# Altium project PCB_Project1.PrjPCB
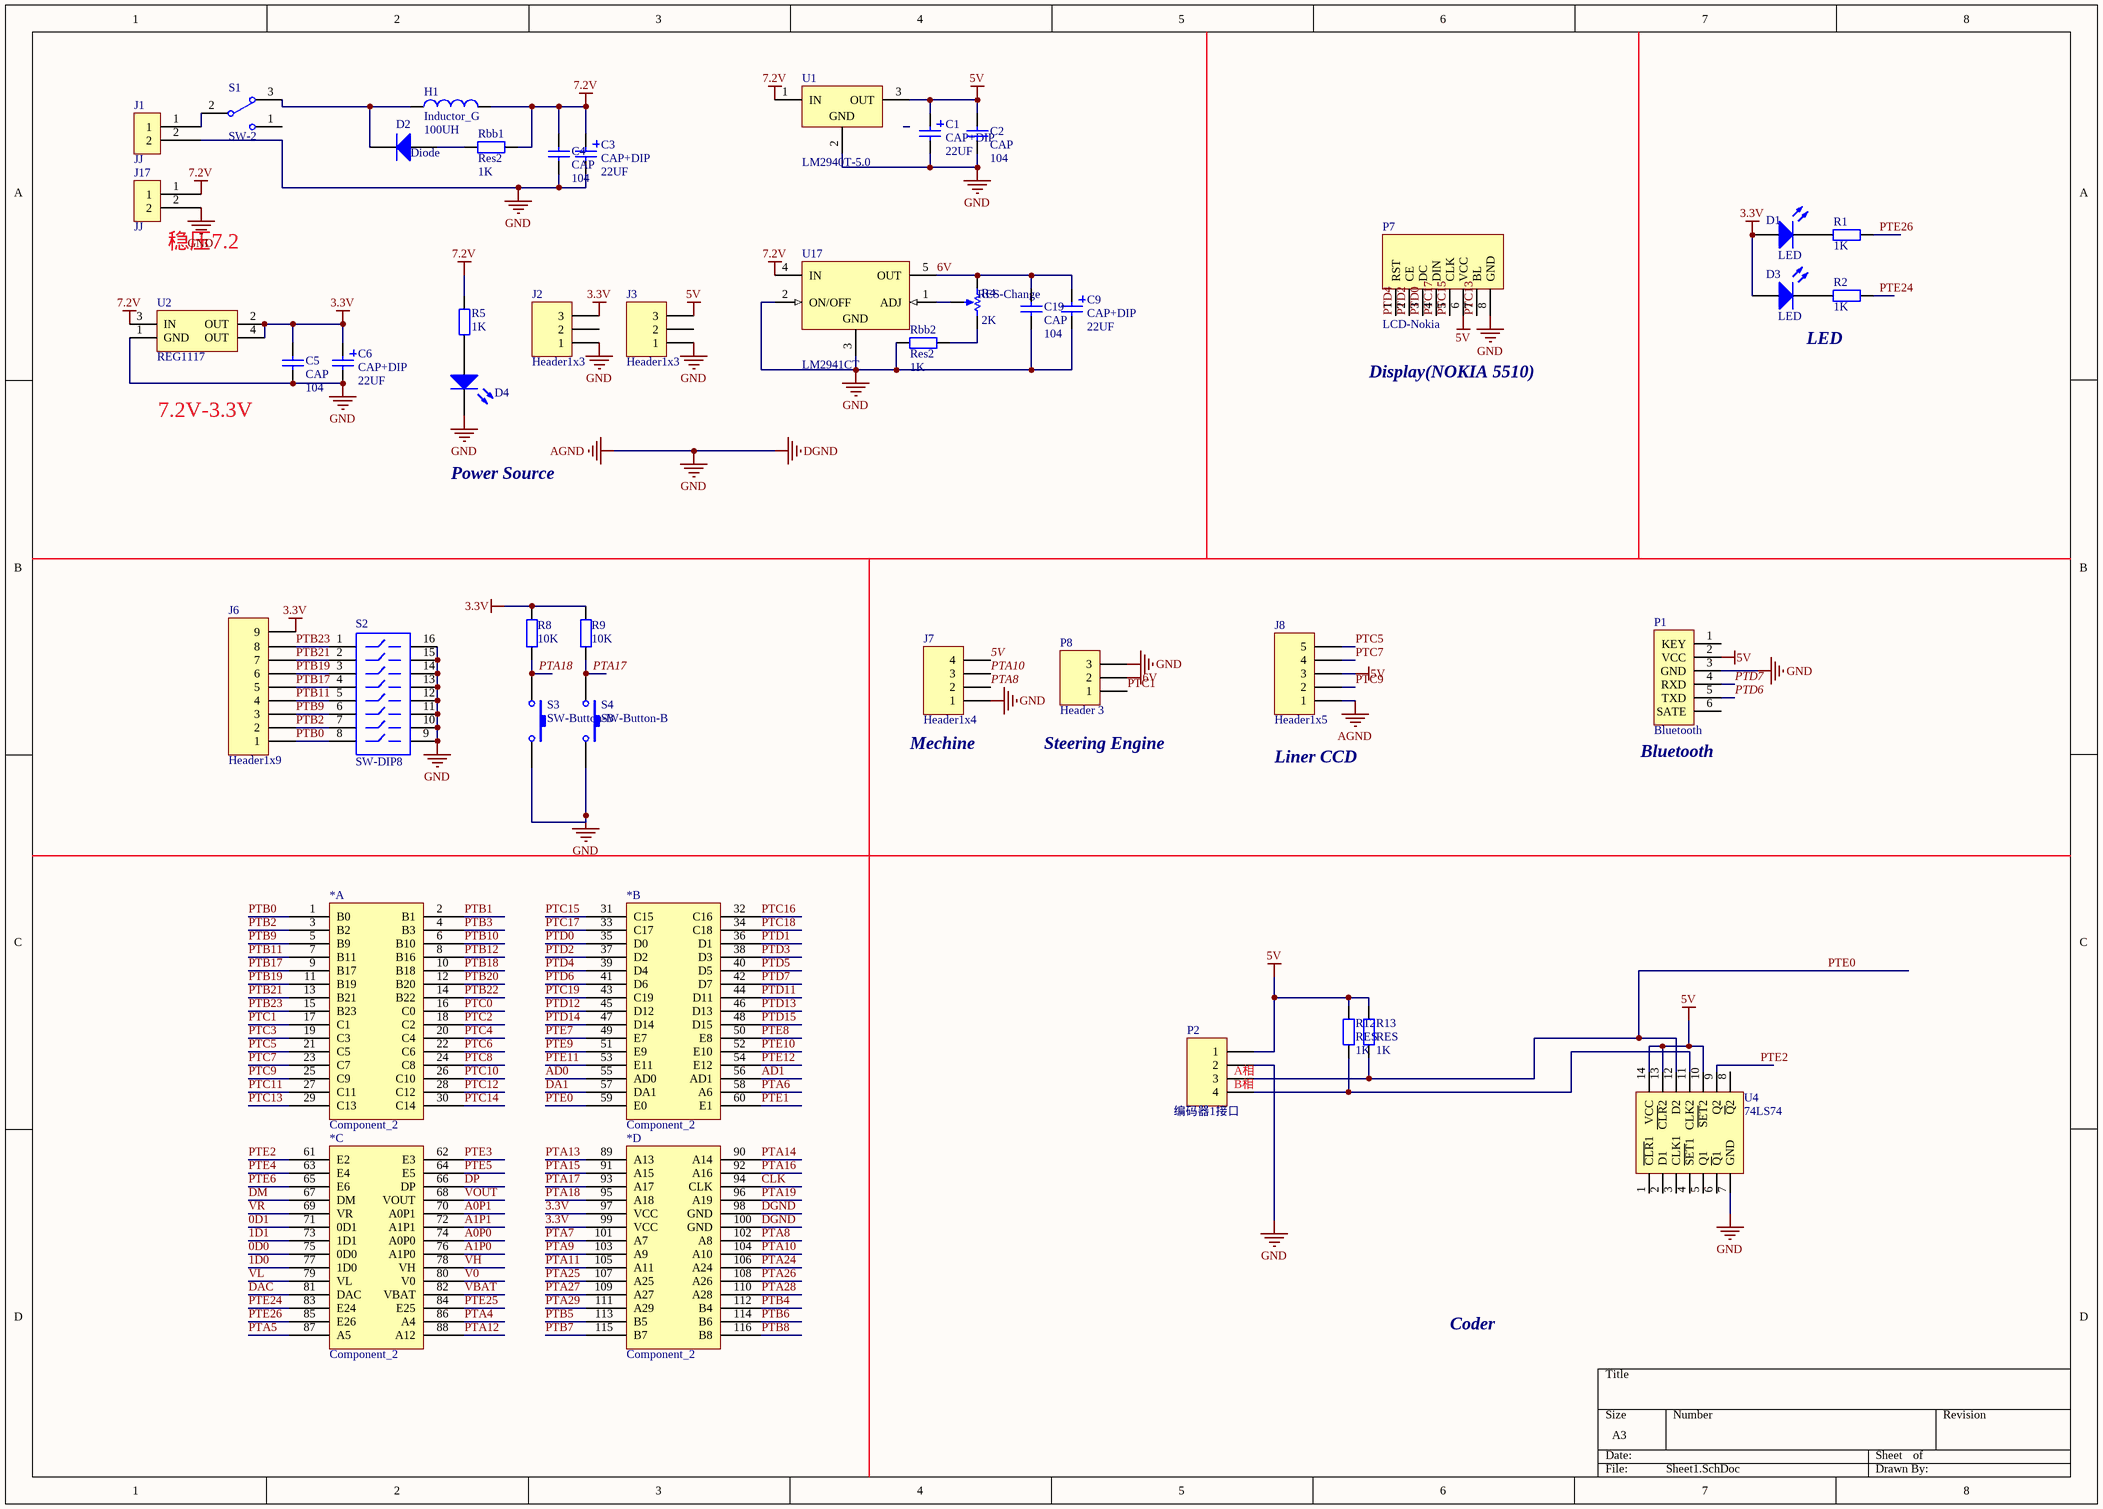
[diagram p0: Sheet1.SchDoc]
1 sheet, 46 parts. Net scope: global (net labels, ports and power ports of the same name join across sheets).
Board file: PCB1.PcbDoc

## Sheet Sheet1.SchDoc
size A3

### Parts
(Parts that share a designator on the sheet are numbered #1, #2 ... from top to bottom, then left to right.)
*#1  Component_2  (part A of 4)
*#2  Component_2  [K60]  (part B of 4)
*#3  Component_2  [K60]  (part C of 4)
*#4  Component_2  (part D of 4)
C1  CAP+DIP  [CAP+DIP]
C2  CAP  [CAP]
C3  CAP+DIP  [CAP+DIP]
C4  CAP  [CAP]
C5  CAP  [CAP]
C6  CAP+DIP  [CAP+DIP]
C9  CAP+DIP  [CAP+DIP]
C19  CAP  [CAP]
D1  LED  [LED]
D2  Diode  [DIODE-DIP]
D3  LED  [LED]
D4  LED  [LED]  (value not drawn)
H1  Inductor_G  [INDUCTOR-G]
J1  JJ  [PCBComponent_1 - duplicate]
J2  Header1x3  [HEADER1X3]
J3  Header1x3  [HEADER1X3]
J6  Header1x9  [HEADER1X9]
J7  Header1x4  [HEADER1X4]
J8  Header1x5  [HEADER1X5]
J17  JJ  [PCBComponent_1 - duplicate]
P1  Bluetooth  [HDR1X6]
P2  编码器1接口  [header1x4]
P7  LCD-Nokia  [LCD-NOKIA]
P8  Header 3  [HDR1X3]
R1  1K  [res a]
R2  1K  [res a]
R4  RES-Change  [RES-Change]
R5  RES  [res]  (value not drawn)
R8  value 10K  [res a]  (hidden comment: Res2)
R9  value 10K  [res a]  (hidden comment: Res2)
R12  RES  [RES a]
R13  RES  [RES a]
Rbb1  Res2  value 1K  [res a]
Rbb2  Res2  value 1K  [res a]
S1  SW-2  [SW-2]
S2  SW-DIP8  [DIP-16]
S3  SW-Button-B  [DPST-4]
S4  SW-Button-B  [DPST-4]
U1  LM2940T-5.0  [T03B]
U2  REG1117  [REG1117]
U4  74LS74  [DIP-14]
U17  LM2941CT  [T05A]

### Nets
3.3V: *#4.97(VCC) *#4.99(VCC) C5.2 C6.1 D1.1(A) D3.1(A) J2.3 J6.9 R8.1 R9.1 U2.2(OUT) U2.4(OUT)
5V: C1.1 C2.2 J3.3 J7.4 J8.3 P1.2(VCC) P2.1 P7.6(VCC) R12.2 R13.2 U1.3(OUT) U4.10(~{SET}2) U4.13(~{CLR}2) U4.14(VCC)
6V: C9.1 C19.2 P8.2 R4.1(TOP) U17.5(OUT)
7.2V: C3.1 C4.2 H1.2 J17.1 R5.1 Rbb1.1 U1.1(IN) U2.3(IN) U17.4(IN)
DGND: *#4.98(GND) *#4.100(GND) C1.2 C2.1 C3.2 C4.1 C5.1 C6.2 C9.2 C19.1 D4.2(K) J1.2 J2.1 J3.1 J7.1 J8.1 J17.2 P1.3(GND) P2.2 P7.8(GND) P8.3 Rbb2.1 S2.9 S2.10 S2.11 S2.12 S2.13 S2.14 S2.15 S2.16 S3.2 S4.2 U1.2(GND) U2.1(GND) U4.7(GND) U17.2(ON/OFF) U17.3(GND)  [also labelled AGND, GND]
0D0: *#3.75(0D0)
0D1: *#3.71(0D1)
1D0: *#3.77(1D0)
1D1: *#3.73(1D1)
A0P0: *#3.74(A0P0)
A0P1: *#3.70(A0P1)
A1P0: *#3.76(A1P0)
A1P1: *#3.72(A1P1)
AD0: *#2.55(AD0)
AD1: *#2.56(AD1)
CLK: *#4.94(CLK)
DA1: *#2.57(DA1)
DAC: *#3.81(DAC)
DM: *#3.67(DM)
DP: *#3.66(DP)
PTA4: *#3.86(A4)
PTA5: *#3.87(A5)
PTA6: *#2.58(A6)
PTA7: *#4.101(A7)
PTA8: *#4.102(A8) J7.2
PTA9: *#4.103(A9)
PTA10: *#4.104(A10) J7.3
PTA11: *#4.105(A11)
PTA12: *#3.88(A12)
PTA13: *#4.89(A13)
PTA14: *#4.90(A14)
PTA15: *#4.91(A15)
PTA16: *#4.92(A16)
PTA17: *#4.93(A17) R9.2 S4.1
PTA18: *#4.95(A18) R8.2 S3.1
PTA19: *#4.96(A19)
PTA24: *#4.106(A24)
PTA25: *#4.107(A25)
PTA26: *#4.108(A26)
PTA27: *#4.109(A27)
PTA28: *#4.110(A28)
PTA29: *#4.111(A29)
PTB0: *#1.1(B0) J6.1 S2.8
PTB1: *#1.2(B1)
PTB2: *#1.3(B2) J6.2 S2.7
PTB3: *#1.4(B3)
PTB4: *#4.112(B4)
PTB5: *#4.113(B5)
PTB6: *#4.114(B6)
PTB7: *#4.115(B7)
PTB8: *#4.116(B8)
PTB9: *#1.5(B9) J6.3 S2.6
PTB10: *#1.6(B10)
PTB11: *#1.7(B11) J6.4 S2.5
PTB12: *#1.8(B16)
PTB17: *#1.9(B17) J6.5 S2.4
PTB18: *#1.10(B18)
PTB19: *#1.11(B19) J6.6 S2.3
PTB20: *#1.12(B20)
PTB21: *#1.13(B21) J6.7 S2.2
PTB22: *#1.14(B22)
PTB23: *#1.15(B23) J6.8 S2.1
PTC0: *#1.16(C0)
PTC1: *#1.17(C1) P8.1
PTC2: *#1.18(C2)
PTC3: *#1.19(C3)
PTC4: *#1.20(C4)
PTC5: *#1.21(C5) J8.5
PTC6: *#1.22(C6)
PTC7: *#1.23(C7) J8.4
PTC8: *#1.24(C8)
PTC9: *#1.25(C9) J8.2
PTC10: *#1.26(C10)
PTC11: *#1.27(C11)
PTC12: *#1.28(C12)
PTC13: *#1.29(C13) P7.7(BL)
PTC14: *#1.30(C14)
PTC15: *#2.31(C15) P7.5(CLK)
PTC16: *#2.32(C16)
PTC17: *#2.33(C17) P7.4(DIN)
PTC18: *#2.34(C18)
PTC19: *#2.43(C19)
PTD0: *#2.35(D0) P7.3(DC)
PTD1: *#2.36(D1)
PTD2: *#2.37(D2) P7.2(CE)
PTD3: *#2.38(D3)
PTD4: *#2.39(D4) P7.1(RST)
PTD5: *#2.40(D5)
PTD6: *#2.41(D6) P1.5(TXD)
PTD7: *#2.42(D7) P1.4(RXD)
PTD11: *#2.44(D11)
PTD12: *#2.45(D12)
PTD13: *#2.46(D13)
PTD14: *#2.47(D14)
PTD15: *#2.48(D15)
PTE0: *#2.59(E0) P2.3 R13.1 U4.12(D2)
PTE1: *#2.60(E1)
PTE2: *#3.61(E2) U4.9(Q2)
PTE3: *#3.62(E3)
PTE4: *#3.63(E4)
PTE5: *#3.64(E5)
PTE6: *#3.65(E6)
PTE7: *#2.49(E7)
PTE8: *#2.50(E8)
PTE9: *#2.51(E9)
PTE10: *#2.52(E10)
PTE11: *#2.53(E11)
PTE12: *#2.54(E12)
PTE24: *#3.83(E24) R2.2
PTE25: *#3.84(E25)
PTE26: *#3.85(E26) R1.2
V0: *#3.80(V0)
VBAT: *#3.82(VBAT)
VH: *#3.78(VH)
VL: *#3.79(VL)
VOUT: *#3.68(VOUT)
VR: *#3.69(VR)
NetD1_2: D1.2(K) R1.1
NetD2_1: D2.1(A) Rbb1.2
NetD2_2: D2.2(K) H1.1 S1.3
NetD3_2: D3.2(K) R2.1
NetD4_1: D4.1(A) R5.2
NetJ1_1: J1.1 S1.2
NetP2_4: P2.4 R12.1 U4.11(CLK2)
NetR4_2: R4.2(BOT) Rbb2.2
NetR4_3: R4.3(TAP) U17.1(ADJ)

Not connected (* = marked no-connect by the designer): J2 2; J3 2; P1 1(KEY) 6(SATE); S1 1; U4 1(~{CLR}1) 2(D1) 3(CLK1) 4(~{SET}1) 5(Q1) 6(~{Q}1) 8(~{Q}2)

### Notes on the sheet
- (near J17) 稳压7.2
- Display(NOKIA 5510)
- LED
- 7.2V-3.3V
- Power Source
- (near J7) Mechine
- (near P8) Steering Engine
- (near J8) Liner CCD
- (near P1) Bluetooth
- (near P2) A相
- (near P2) B相
- Coder
- (in symbol CAP) 104
- (in symbol Inductor_G) 100UH

### Library data of the parts
P2 = Header 4: Header, 4-Pin; LatestRevisionDate: 17-Jul-2002; LatestRevisionNote: Re-released for DXP Platform.; Publisher: Altium Limited
P8 = Header 3: Header, 3-Pin; LatestRevisionDate: 17-Jul-2002; LatestRevisionNote: Re-released for DXP Platform.; Publisher: Altium Limited
R1 R2 = Res1
R8 R9 Rbb1 Rbb2 = Res2: Resistor; Published: 8-Jun-2000; LatestRevisionDate: 17-Jul-2002; LatestRevisionNote: Re-released for DXP Platform.; PackageReference: AXIAL-0.4; Publisher: Altium Limited
U1 = LM2940T-5.0: 1A Low Dropout Regulator, 3-pin TO-220; Manufacturer: National Semiconductor; PackageTopMarking: NSUZXYTTE#*LM2940T*-5.0 P+; PowerWise: N; CompType: LDO IC; Published: 4-Dec-2008; DatasheetVersion: Jan-2007; PackageVersion: revL, Jan-1992; PackageReference: T03B; Publisher: Altium Limited; PackageDescription: TO-220, Molded, 3 Lead, Straight; Supplier 1: Farnell; Supplier Part Number 1: 1523854; Supplier 2: Farnell; Supplier Part Number 2: 9490205; PartNumber: LM2940T-5.0; RoHS: N; PinCount: 3; ComponentLink1Description: LM2940 Datasheet; ComponentLink1URL: http://www.national.com/ds/LM/LM2940.pdf; ComponentLink2Description: LM2940 Web Page; ComponentLink2URL: http://www.national.com/pf/LM/LM2940.html; ComponentLink3Description: T03B Package Page; ComponentLink3URL: http://www.national.com/packaging/folders/t03b.html
U17 = LM2941CT: 1A Low Dropout Adjustable Regulator, 5-pin TO-220; Manufacturer: National Semiconductor; PackageTopMarking: NSUZXYTTE#*LM2941CT*P+; PowerWise: N; CompType: LDO IC; Published: 4-Dec-2008; DatasheetVersion: Nov-2007; PackageVersion: revJ, Jan-1992; PackageReference: T05A; Publisher: Altium Limited; PackageDescription: TO-220, Molded, 5 Lead, Straight; Supplier 1: Farnell; Supplier Part Number 1: 9489371; PartNumber: LM2941CT; RoHS: N; PinCount: 5; Code_JEDEC: TO-220-AB; ComponentLink1Description: LM2941C Datasheet; ComponentLink1URL: http://www.national.com/ds/LM/LM2941C.pdf; ComponentLink2Description: LM2941C Web Page; ComponentLink2URL: http://www.national.com/pf/LM/LM2941C.html; ComponentLink3Description: T05A Package Page; ComponentLink3URL: http://www.national.com/packaging/folders/t05a.html